# EasyEDA Pro project port.eprj

# Schematic Schematic1
Board Name: Board1; Create Date: 2025-05-24; Page Name: P1; Project Name: port_2025-05-24_13-21-27; Schematic Name: Schematic1; Update Date: 2025-05-24; Company: 嘉立创EDA; Page Size: A4; Version: V1.0
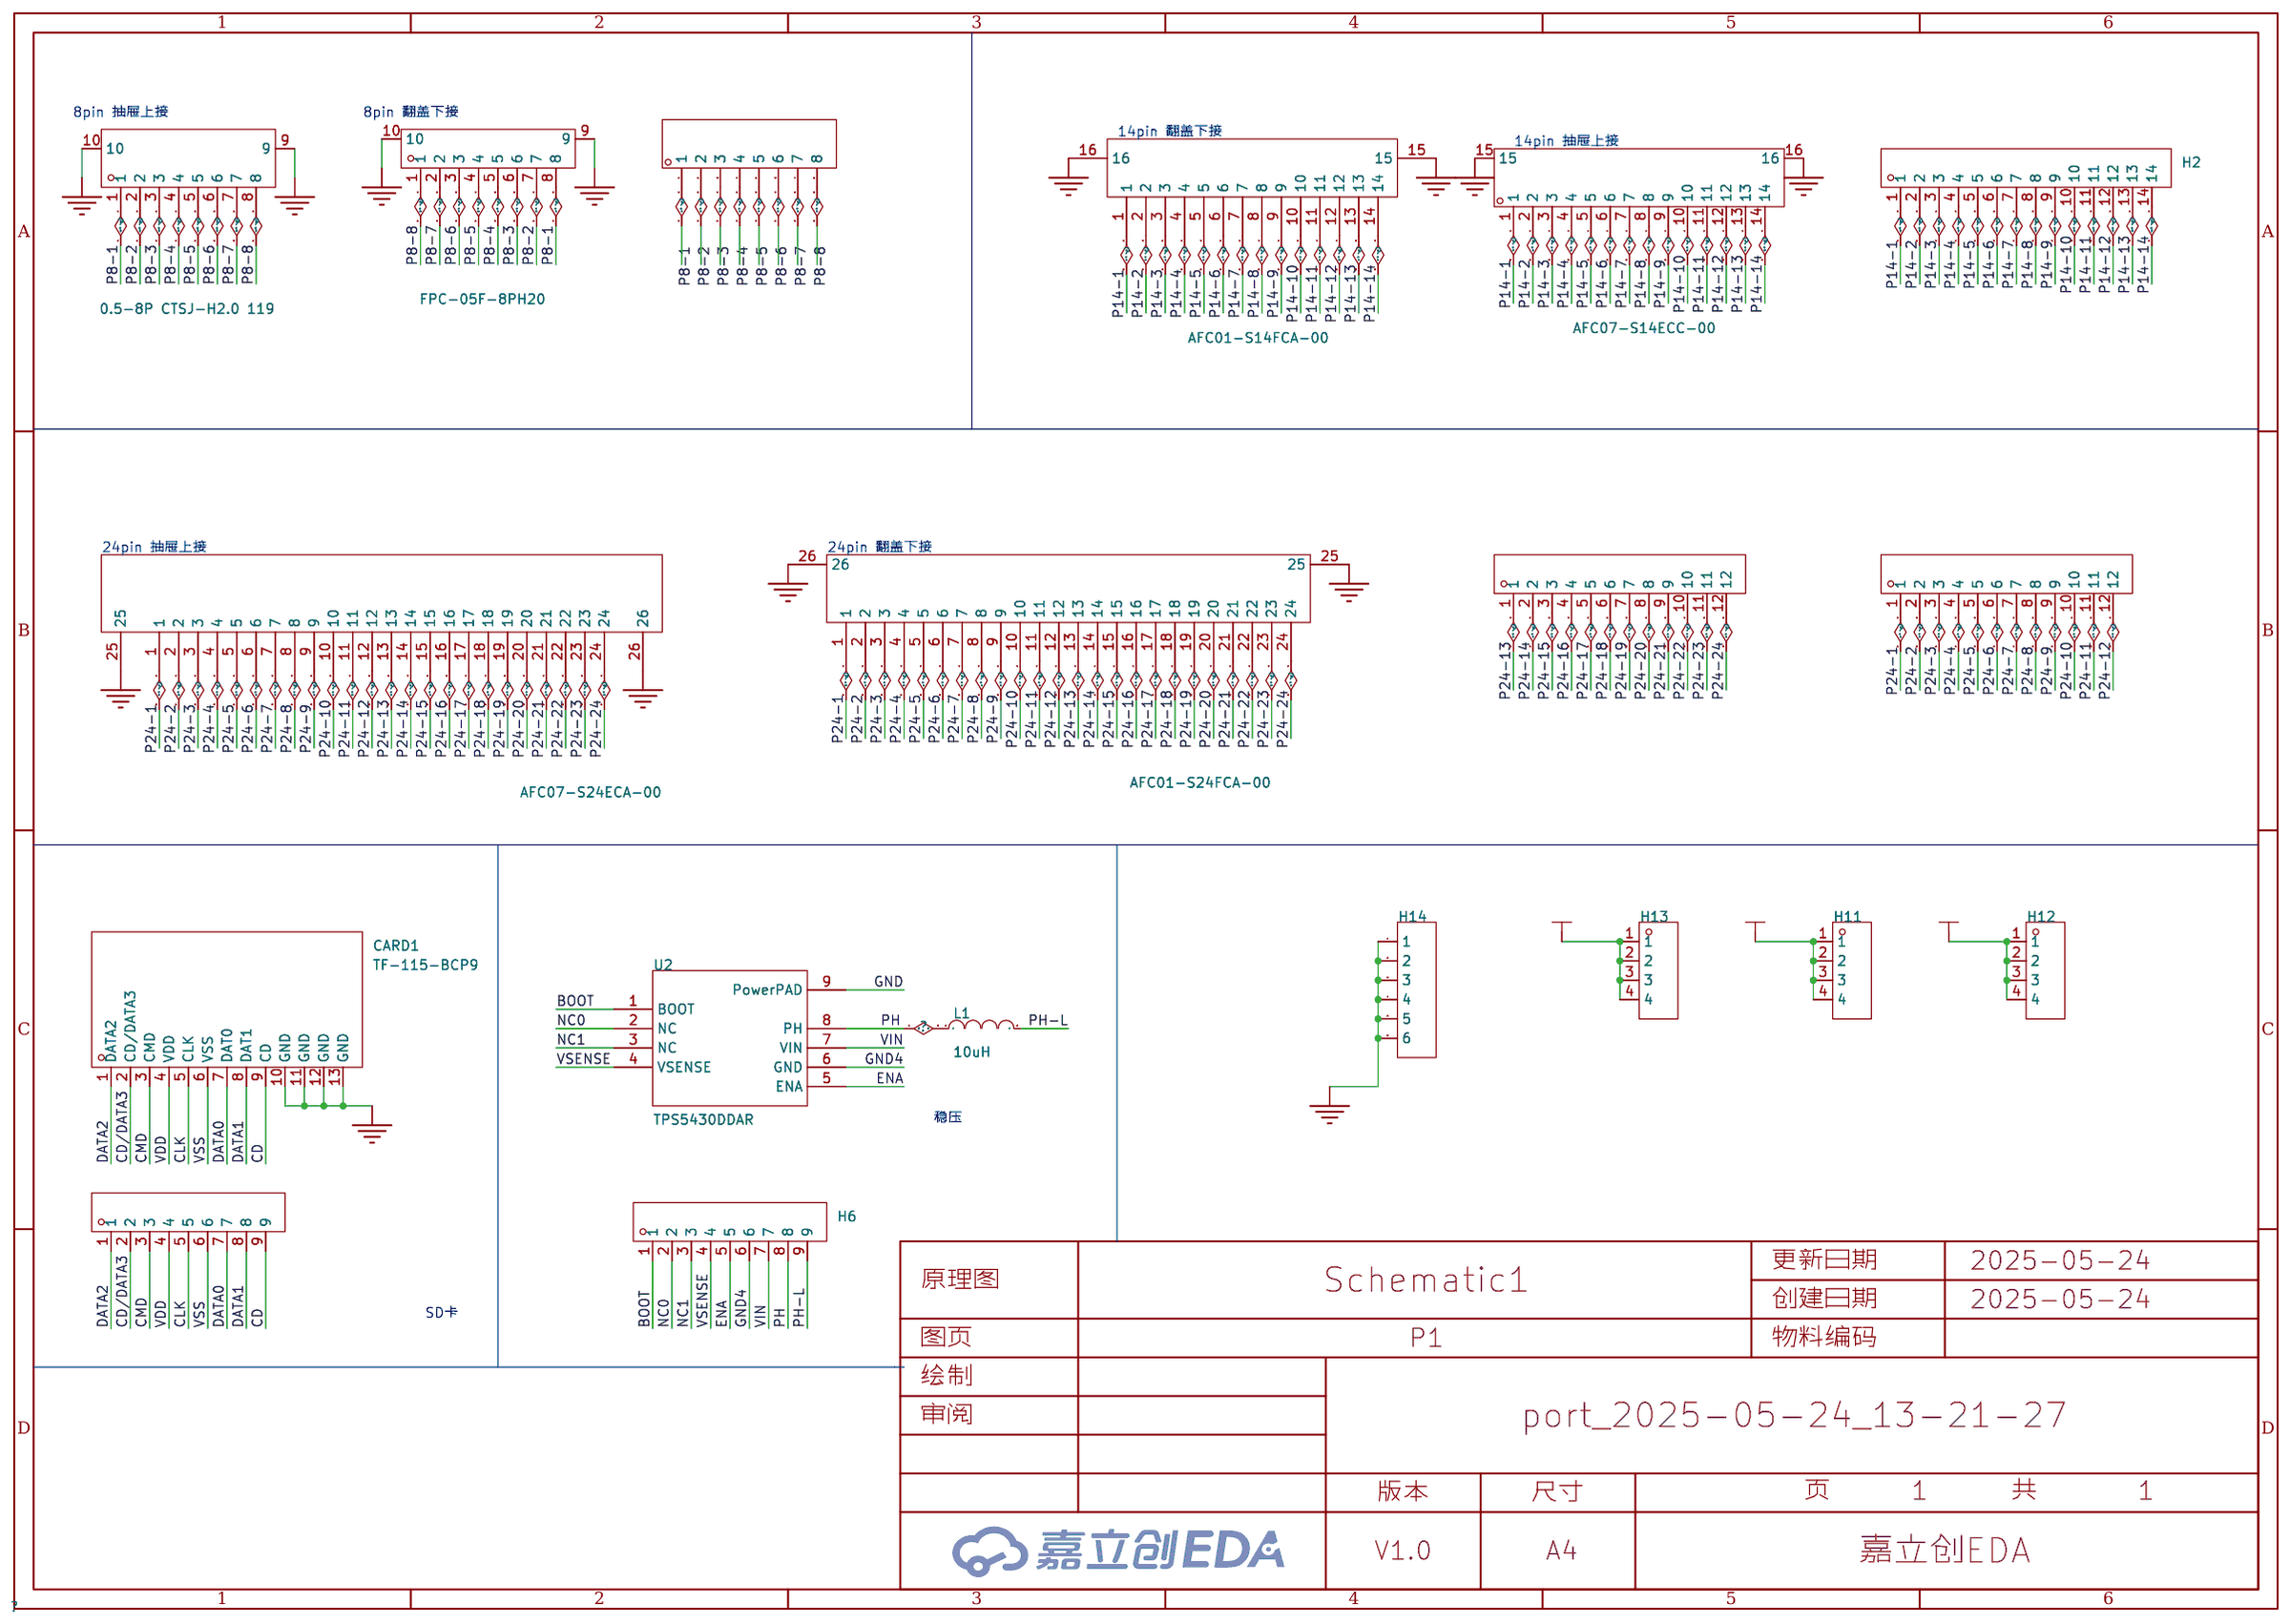
[diagram p0: schematic sheet]

## Parts
CARD1  TF-115-BCP9  [TF-SMD_TF-115-BCP9]
FPC1  FPC-05F-8PH20  [FPC-SMD_8P-P0.50_FPC-05F-8PH20]
FPC2  AFC07-S24ECA-00  [FPC-SMD_AFC07-S24ECA-00]
FPC3  AFC01-S24FCA-00  [FPC-SMD_24P-P0.50_AFC01-S24FCA-00]
H1  -  [HDR-TH_8P-P2.54-V-M]
H2  -  [HDR-TH_14P-P2.54-V-M]
H3  -  [HDR-TH_12P-P2.54-V-M]
H4  -  [HDR-TH_12P-P2.54-V-M]
H6  -  [HDR-TH_9P-P2.54-V-M]
H10  -  [HDR-TH_9P-P2.54-V-M]
H11  -  [HDR-TH_4P-P2.54-V-M]
H12  -  [HDR-TH_4P-P2.54-V-M]
H13  -  [HDR-TH_4P-P2.54-V-M]
H14  -  [HDR-TH_6P-P2.54-V-M-1]
L1  10uH  [L0805]
P1  AFC07-S14ECC-00  [FPC-SMD_14P-L12.5-W5.4-P0.50]
U1  0.5-8P CTSJ-H2.0 119  [FPC-SMD_8P-P0.50_SHOUHAN_CTSJ-H2.0]
U2  TPS5430DDAR  [ESOP-8_L4.9-W3.9-P1.27-LS6.0-TL-EP]
X1  AFC01-S14FCA-00  [FPC-SMD_AFC01-S14FCA-00]

## Library data of the parts
CARD1 = TF-115-BCP9: 卡连接方式:自弹式;卡类型:MicroSD卡(TF卡);连接器类型:卡座;本体最大高度:1.8mm;工作温度范围:-25℃~+85℃;; LCSC Part Name: 自弹式 MicroSD卡(TF卡) 卡座; Supplier Part: C720505; Manufacturer: XUNPU(讯普); Supplier Footprint: SMD; JLCPCB Part Class: 扩展库; Datasheet: https://atta.szlcsc.com/upload/public/pdf/source/20210906/DBEC8F03AA1503572333C7CF4A76D0AD.pdf; Supplier: LCSC; Card Connection Mode: 自弹式; Card Type: MicroSD卡(TF卡); Connector Type: 卡座; Maximum Body Height: 1.8mm; Operating Temperature Range: -25℃~+85℃
FPC1 = FPC-05F-8PH20: LCSC Part Name: 间距:0.5mm P数:8P 翻盖式 下接; Supplier Part: C2856797; Manufacturer: XUNPU(讯普); Supplier Footprint: SMD,P=0.5mm,卧贴; JLCPCB Part Class: 扩展库; Datasheet: https://atta.szlcsc.com/upload/public/pdf/source/20210728/C2856796_EA80EFD10E16055FE067E7763B90421F.pdf; Supplier: LCSC; Locking Feature: 翻盖式; Contact Type: 下接; Number of Contacts: 8P; Pitch: 0.5mm; Mounting Type: 卧贴; FFC, FCB Thickness: 0.3mm; Height Above Board: 2mm; Operating Temperature Range: -25℃~+85℃
FPC2 = AFC07-S24ECA-00: LCSC Part Name: 间距:0.5mm P数:24P 抽屉式 上接; Supplier Part: C262643; Manufacturer: JS(钜硕电子); Supplier Footprint: SMD,P=0.5mm,卧贴; JLCPCB Part Class: 扩展库; Datasheet: https://atta.szlcsc.com/upload/public/pdf/source/20190726/C11082_A2E7B12387019CE4314BB5199EE0FDF4.pdf; Supplier: LCSC; Locking Feature: 抽屉式; Contact Type: 上接; Number of Contacts: 24P; Pitch: 0.5mm; Mounting Type: 卧贴; FFC, FCB Thickness: 0.3mm; Height Above Board: 2mm
FPC3 = AFC01-S24FCA-00: LCSC Part Name: 间距:0.5mm P数:24P 翻盖式 下接; Supplier Part: C262669; Manufacturer: JS(钜硕电子); Supplier Footprint: SMD,P=0.5mm,卧贴; JLCPCB Part Class: 扩展库; Datasheet: https://atta.szlcsc.com/upload/public/pdf/source/20190816/C413942_2A72D1AC756EAE17EEDF756A339D4500.pdf; Supplier: LCSC; Locking Feature: 翻盖式; Contact Type: 下接; Number of Contacts: 24P; Pitch: 0.5mm; Mounting Type: 卧贴; FFC, FCB Thickness: 0.3mm; Height Above Board: 2mm
H1 = HDR-M_2.54_1x8P: Supplier Part: C124381; Supplier Footprint: 插件
H2 = HDR-M_2.54_1x14P: Supplier Part: C2894937; Supplier Footprint: 插件
H3 H4 = HDR-M_2.54_1x12P: Supplier Part: C2840012; Supplier Footprint: 插件
H6 H10 = HDR-M_2.54-1x9P: Supplier Part: C492408; Supplier Footprint: 插件
H11-H13 = HDR-M_2.54_1x4P: Supplier Part: C492403; Supplier Footprint: 插件
H14 = HDR-M_2.54_1x6P: Supplier Part: C37208; Supplier Footprint: 插件
L1 = L_0805
P1 = AFC07-S14ECC-00: LCSC Part Name: 间距:0.5mm P数:14P 抽屉式 上接; Supplier Part: C11087; Manufacturer: JS(钜硕电子); Supplier Footprint: SMD,P=0.5mm,卧贴; JLCPCB Part Class: 扩展库; Datasheet: https://atta.szlcsc.com/upload/public/pdf/source/20130129/1457706582878.pdf; Supplier: LCSC; Locking Feature: 抽屉式; Contact Type: 上接; Number of Contacts: 14P; Pitch: 0.5mm; Mounting Type: 卧贴; FFC, FCB Thickness: 0.3mm; Height Above Board: 2mm
U1 = 0.5-8P CTSJ-H2.0 119: LCSC Part Name: 抽屉式 上接 P数:8P 间距:0.5mm; Supplier Part: C5373445; Manufacturer: SHOU HAN(首韩); Supplier Footprint: SMD,P=0.5mm,卧贴; JLCPCB Part Class: 扩展库; Datasheet: https://atta.szlcsc.com/upload/public/pdf/source/20230321/75B120D7DB190323108EF86CD5D5939A.pdf; Supplier: LCSC; Locking Feature: 抽屉式; Contact Type: 上接; Number of Contacts: 8P; Pitch: 0.5mm; Mounting Type: 卧贴; FFC, FCB Thickness: 0.3mm; Height Above Board: 2mm; Contact Material: 磷青铜; Contact Plating: 锡; Operating Temperature Range: -55℃~+85℃
U2 = TPS5430DDAR: LCSC Part Name: 宽输入范围、3A输出电流的降压转换器; Supplier Part: C9864; Manufacturer: TI(德州仪器); Supplier Footprint: SOIC-8-EP; JLCPCB Part Class: 基础库; Datasheet: https://www.ti.com/cn/lit/gpn/tps5430; Supplier: LCSC; Function: 降压型; Output Type: 可调; Input Voltage: 5.5V~36V; Output Voltage: 1.221V~32.04V; Output Current: 3A; Switching Frequency: 500kHz; Operating Temperature: -40℃~+125℃@(TJ); Synchronous Rectification: 否; Number of Outputs: 1; Topology: 降压式; Switch tube (built-in/external): 内置
X1 = AFC01-S14FCA-00: LCSC Part Name: 间距:0.5mm P数:14P 翻盖式 下接; Supplier Part: C262663; Manufacturer: JS(钜硕电子); Supplier Footprint: SMD,P=0.5mm,卧贴; JLCPCB Part Class: 扩展库; Datasheet: https://atta.szlcsc.com/upload/public/pdf/source/20190816/C413942_2A72D1AC756EAE17EEDF756A339D4500.pdf; Supplier: LCSC; Locking Feature: 翻盖式; Contact Type: 下接; Number of Contacts: 14P; Pitch: 0.5mm; Mounting Type: 卧贴; FFC, FCB Thickness: 0.3mm; Height Above Board: 2mm

## Nets
GND: CARD1.10(GND) CARD1.11(GND) CARD1.12(GND) CARD1.13(GND) FPC1.9 FPC1.10 FPC2.25 FPC2.26 FPC3.25 FPC3.26 H14.1 H14.2 H14.3 H14.4 H14.5 H14.6 P1.15 P1.16 U1.9 U1.10 U2.9(PowerPAD) X1.15 X1.16
GND4: H6.6 U2.6(GND)
VDD: CARD1.4(VDD) H10.4
VIN: H6.7 U2.7(VIN)
VSS: CARD1.6(VSS) H10.6
BOOT: H6.1 U2.1(BOOT)
CD: CARD1.9(CD) H10.9
CD/DATA3: CARD1.2(CD/DATA3) H10.2
CLK: CARD1.5(CLK) H10.5
CMD: CARD1.3(CMD) H10.3
DATA0: CARD1.7(DAT0) H10.7
DATA1: CARD1.8(DAT1) H10.8
DATA2: CARD1.1(DATA2) H10.1
ENA: H6.5 U2.5(ENA)
NC0: H6.2 U2.2(NC)
NC1: H6.3 U2.3(NC)
P8-1: FPC1.8 H1.1 U1.1
P8-2: FPC1.7 H1.2 U1.2
P8-3: FPC1.6 H1.3 U1.3
P8-4: FPC1.5 H1.4 U1.4
P8-5: FPC1.4 H1.5 U1.5
P8-6: FPC1.3 H1.6 U1.6
P8-7: FPC1.2 H1.7 U1.7
P8-8: FPC1.1 H1.8 U1.8
P14-1: H2.1 P1.1 X1.1
P14-2: H2.2 P1.2 X1.2
P14-3: H2.3 P1.3 X1.3
P14-4: H2.4 P1.4 X1.4
P14-5: H2.5 P1.5 X1.5
P14-6: H2.6 P1.6 X1.6
P14-7: H2.7 P1.7 X1.7
P14-8: H2.8 P1.8 X1.8
P14-9: H2.9 P1.9 X1.9
P14-10: H2.10 P1.10 X1.10
P14-11: H2.11 P1.11 X1.11
P14-12: H2.12 P1.12 X1.12
P14-13: H2.13 P1.13 X1.13
P14-14: H2.14 P1.14 X1.14
P24-1: FPC2.1 FPC3.1 H3.1
P24-2: FPC2.2 FPC3.2 H3.2
P24-3: FPC2.3 FPC3.3 H3.3
P24-4: FPC2.4 FPC3.4 H3.4
P24-5: FPC2.5 FPC3.5 H3.5
P24-6: FPC2.6 FPC3.6 H3.6
P24-7: FPC2.7 FPC3.7 H3.7
P24-8: FPC2.8 FPC3.8 H3.8
P24-9: FPC2.9 FPC3.9 H3.9
P24-10: FPC2.10 FPC3.10 H3.10
P24-11: FPC2.11 FPC3.11 H3.11
P24-12: FPC2.12 FPC3.12 H3.12
P24-13: FPC2.13 FPC3.13 H4.1
P24-14: FPC2.14 FPC3.14 H4.2
P24-15: FPC2.15 FPC3.15 H4.3
P24-16: FPC2.16 FPC3.16 H4.4
P24-17: FPC2.17 FPC3.17 H4.5
P24-18: FPC2.18 FPC3.18 H4.6
P24-19: FPC2.19 FPC3.19 H4.7
P24-20: FPC2.20 FPC3.20 H4.8
P24-21: FPC2.21 FPC3.21 H4.9
P24-22: FPC2.22 FPC3.22 H4.10
P24-23: FPC2.23 FPC3.23 H4.11
P24-24: FPC2.24 FPC3.24 H4.12
PH: H6.8 L1.1 U2.8(PH)
PH-L: H6.9 L1.2
PIN0: H11.1 H11.2 H11.3 H11.4
PIN1: H12.1 H12.2 H12.3 H12.4
PIN2: H13.1 H13.2 H13.3 H13.4
VSENSE: H6.4 U2.4(VSENSE)

## Notes on the sheet
- 8pin 抽屉上接
- 8pin 翻盖下接
- 14pin 翻盖下接
- 14pin 抽屉上接
- 24pin 抽屉上接
- 24pin 翻盖下接
- 稳压
- SD卡

# Board PCB1
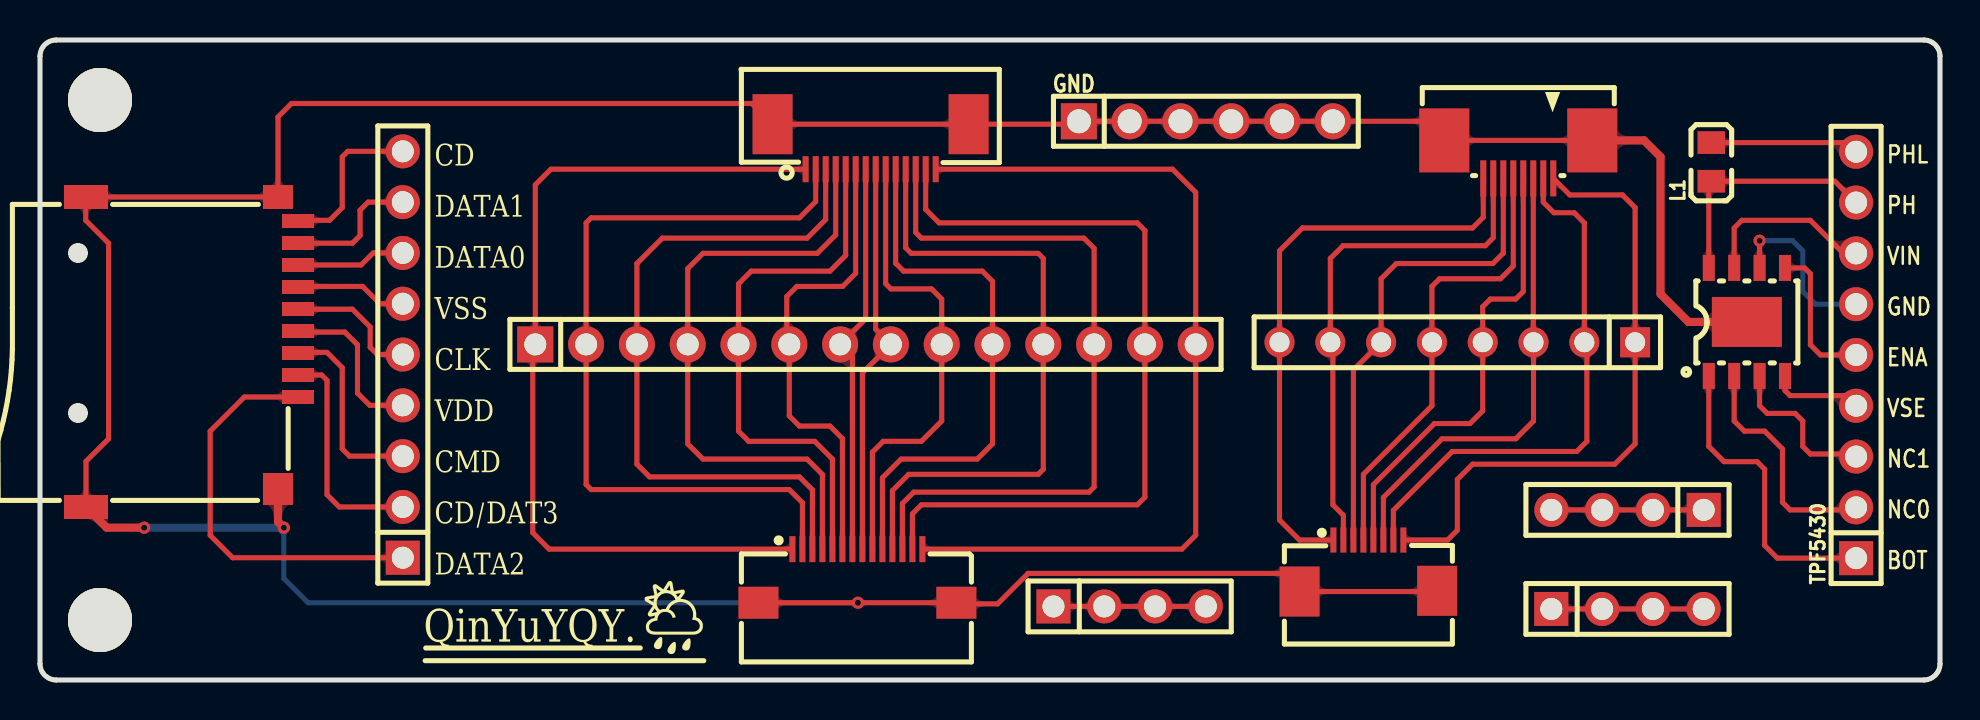
[diagram p1: board, top side]
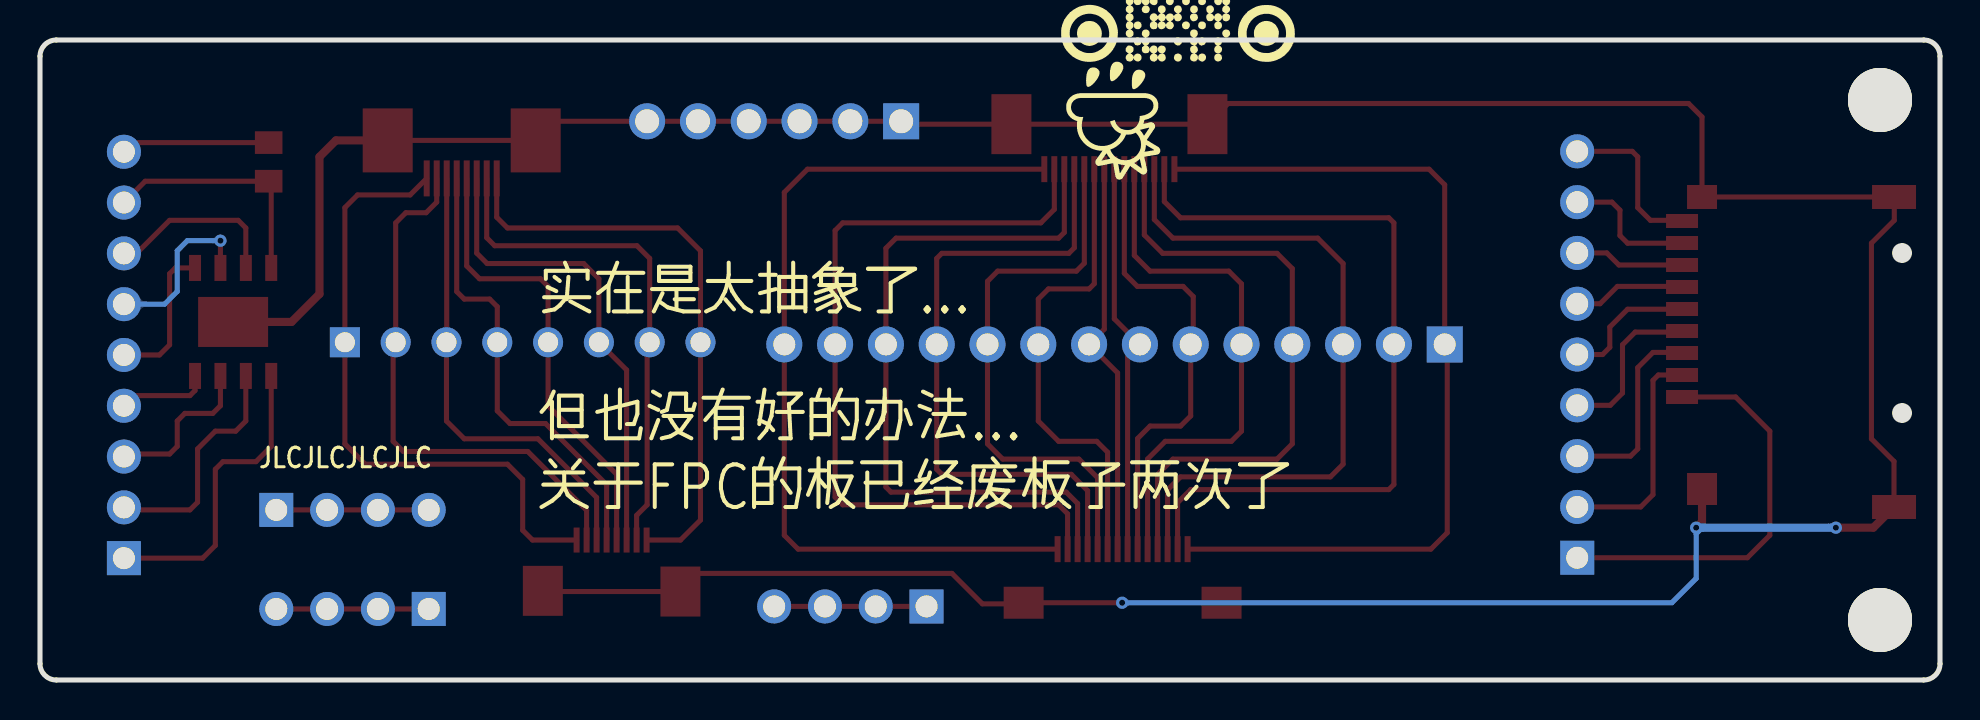
[diagram p2: board, bottom side, seen from below]

Outline 95 x 32 mm; copper layers: Top Layer, Bottom Layer. Coordinates in mm from the lower left corner of the outline.
Outline path: 0,31.19 0,0.81 arc(0.24,0.24) 0.81,0 94.19,0 arc(94.76,0.24) 95,0.81 95,31.19 arc(94.76,31.76) 94.19,32 0.81,32 arc(0.24,31.76) 0,31.19
Stack: Top Layer 0.035mm / Dielectric1 1.51mm FR4 er 4.5 / Bottom Layer 0.035mm

## Design rules (mm)
template: 自定义配置
spacing copperThickness1oz (default): track to track 0.102, other pairs 0.102 to 0.3
spacing copperThickness2oz: track to track 0.203, other pairs 0.152 to 0.3
track width copperThickness1oz (default): min 0.127, default 0.254, max 2.54
track width copperThickness2oz: min 0.203, default 0.254, max 2.54
differential pair differentialPair (default): width min 0.127, default 0.254, max 2.54; gap min 0.152, default 0.152
via viaSize (default): diameter min 0.5, default 0.61, max 10; hole min 0.3, default 0.305, max 6.299

## Placement (name value [footprint] x y rotation side)
CARD1  TF-115-BCP9  [TF-SMD_TF-115-BCP9]  7.6 16.4 270 top
FPC1  FPC-05F-8PH20  [FPC-SMD_8P-P0.50_FPC-05F-8PH20]  66.42 5.71 0 top
H1  -  [HDR-TH_8P-P2.54-V-M]  70.87 16.89 180 top
H2  -  [HDR-TH_14P-P2.54-V-M]  41.28 16.78 0 top
H10  -  [HDR-TH_9P-P2.54-V-M]  18.14 16.27 90 top
H11  -  [HDR-TH_4P-P2.54-V-M]  54.48 3.68 0 top
H12  -  [HDR-TH_4P-P2.54-V-M]  79.38 3.55 0 top
H13  -  [HDR-TH_4P-P2.54-V-M]  79.38 8.5 180 top
H14  -  [HDR-TH_6P-P2.54-V-M-1]  58.29 27.94 0 top
L1  10uH  [L0805]  83.57 25.9 90 top
P1  AFC07-S14ECC-00  [FPC-SMD_14P-L12.5-W5.4-P0.50]  41.53 26.67 180 top
SCREW1  -  [M3螺丝]  3 29 0 top
SCREW2  -  [M3螺丝]  3 3 0 top
TPF5430  -  [HDR-TH_9P-P2.54-V-M]  90.81 16.25 90 top
U1  0.5-8P CTSJ-H2.0 119  [FPC-SMD_8P-P0.50_SHOUHAN_CTSJ-H2.0]  73.91 26.03 180 top
U2  TPS5430DDAR  [ESOP-8_L4.9-W3.9-P1.27-LS6.0-TL-EP]  85.34 17.9 90 top
X1  AFC01-S14FCA-00  [FPC-SMD_AFC01-S14FCA-00]  40.87 5.2 0 top

## Footprints (pads in the part's own frame, mm; a bottom-side part is the same pattern mirrored in y, then rotated)
ESOP-8_L4.9-W3.9-P1.27-LS6.0-TL-EP
  rect 1.3x0.6 smd: 1(-2.7,1.905) 2(-2.7,0.635) 3(-2.7,-0.635) 4(-2.7,-1.905) 5(2.7,-1.905) 6(2.7,-0.635) 7(2.7,0.635) 8(2.7,1.905)
  rect 2.5x3.5 smd: 9(0,0)
FPC-SMD_8P-P0.50_FPC-05F-8PH20
  rect 0.3x1.25 smd: 1(-1.75,1.288) 2(-1.25,1.288) 3(-0.75,1.288) 4(-0.25,1.288) 5(0.25,1.288) 6(0.75,1.288) 7(1.25,1.288) 8(1.75,1.288)
  rect 2x2.5 smd: 9(3.44,-1.252) 10(-3.44,-1.288)
FPC-SMD_8P-P0.50_SHOUHAN_CTSJ-H2.0
  rect 0.3x1.8 smd: 1(-1.75,0.95) 2(-1.25,0.95) 3(-0.75,0.95) 4(-0.25,0.95) 5(0.25,0.95) 6(0.75,0.95) 7(1.25,0.95) 8(1.75,0.95)
  rect 2.5x3.2 smd: 9(3.7,-0.95) 10(-3.7,-0.95)
FPC-SMD_14P-L12.5-W5.4-P0.50
  rect 0.3x1.3 smd: 1(3.249,1.125) 2(2.745,1.125) 3(2.245,1.125) 4(1.745,1.125) 5(1.245,1.125) 6(0.745,1.125) 7(0.245,1.125) 8(-0.255,1.125) 9(-0.755,1.125) 10(-1.255,1.125) 11(-1.755,1.125) 12(-2.255,1.125) 13(-2.755,1.125) 14(-3.255,1.125)
  rect 2x3 smd: 15(-4.901,-1.125) 16(4.901,-1.125)
FPC-SMD_AFC01-S14FCA-00
  rect 0.3x1.3 smd: 1(-3.25,1.34) 2(-2.75,1.339) 3(-2.25,1.34) 4(-1.75,1.34) 5(-1.25,1.34) 6(-0.75,1.34) 7(-0.25,1.34) 8(0.25,1.34) 9(0.75,1.34) 10(1.25,1.34) 11(1.75,1.34) 12(2.25,1.34) 13(2.75,1.34) 14(3.25,1.34)
  rect 2x1.6 smd: 15(4.948,-1.34) 16(-4.948,-1.34)
HDR-TH_4P-P2.54-V-M
  rect 1.7x1.7 hole 1.1: 1(-3.81,0)
  round 1.7 hole 1.1: 2(-1.27,0) 3(1.27,0) 4(3.81,0)
HDR-TH_6P-P2.54-V-M-1
  rect 1.8x1.8 hole 1.2: 1(-6.35,0)
  round 1.8 hole 1.2: 2(-3.81,0) 3(-1.27,0) 4(1.27,0) 5(3.81,0) 6(6.35,0)
HDR-TH_8P-P2.54-V-M
  rect 1.5x1.5 hole 1: 1(-8.89,0)
  round 1.5 hole 1: 2(-6.35,0) 3(-3.81,0) 4(-1.27,0) 5(1.27,0) 6(3.81,0) 7(6.35,0) 8(8.89,0)
HDR-TH_9P-P2.54-V-M
  rect 1.7x1.7 hole 1.1: 1(-10.16,0)
  round 1.7 hole 1.1: 2(-7.62,0) 3(-5.08,0) 4(-2.54,0) 5(0,0) 6(2.54,0) 7(5.08,0) 8(7.62,0) 9(10.16,0)
HDR-TH_14P-P2.54-V-M
  rect 1.8x1.8 hole 1.1: 1(-16.51,0)
  round 1.8 hole 1.1: 2(-13.97,0) 3(-11.43,0) 4(-8.89,0) 5(-6.35,0) 6(-3.81,0) 7(-1.27,0) 8(1.27,0) 9(3.81,0) 10(6.35,0) 11(8.89,0) 12(11.43,0) 13(13.97,0) 14(16.51,0)
L0805
  rect 1.133x1.377 smd: 1(-0.966,0) 2(0.966,0)
M3螺丝
  round 3.2 hole 3.2: 1(0,0)
TF-SMD_TF-115-BCP9
  rect 0.7x1.6 smd: 1(2.25,5.3) 2(1.15,5.3) 3(0.05,5.3) 4(-1.05,5.3) 5(-2.15,5.3) 6(-3.25,5.3) 7(-4.35,5.3) 8(-5.45,5.3) 9(-6.55,5.3)
  rect 1.2x1.5 smd: 10(-7.75,4.3)
  rect 1.2x2.2 smd: 11(-7.75,-5.3) 13(7.75,-5.3)
  rect 1.6x1.5 smd: 12(6.85,4.3)

## Nets
GND: CARD1.10 CARD1.11 CARD1.12 CARD1.13 FPC1.9 FPC1.10 H14.1 H14.2 H14.3 H14.4 H14.5 H14.6 P1.15 P1.16 U1.9 U1.10 U2.9 X1.15 X1.16
GND4: TPF5430.6 U2.6
VDD: CARD1.4 H10.4
VIN: TPF5430.7 U2.7
VSS: CARD1.6 H10.6
BOOT: TPF5430.1 U2.1
CD: CARD1.9 H10.9
CD/DATA3: CARD1.2 H10.2
CLK: CARD1.5 H10.5
CMD: CARD1.3 H10.3
DATA0: CARD1.7 H10.7
DATA1: CARD1.8 H10.8
DATA2: CARD1.1 H10.1
ENA: TPF5430.5 U2.5
NC0: TPF5430.2 U2.2
NC1: TPF5430.3 U2.3
P8-1: FPC1.8 H1.1 U1.1
P8-2: FPC1.7 H1.2 U1.2
P8-3: FPC1.6 H1.3 U1.3
P8-4: FPC1.5 H1.4 U1.4
P8-5: FPC1.4 H1.5 U1.5
P8-6: FPC1.3 H1.6 U1.6
P8-7: FPC1.2 H1.7 U1.7
P8-8: FPC1.1 H1.8 U1.8
P14-1: H2.1 P1.1 X1.1
P14-2: H2.2 P1.2 X1.2
P14-3: H2.3 P1.3 X1.3
P14-4: H2.4 P1.4 X1.4
P14-5: H2.5 P1.5 X1.5
P14-6: H2.6 P1.6 X1.6
P14-7: H2.7 P1.7 X1.7
P14-8: H2.8 P1.8 X1.8
P14-9: H2.9 P1.9 X1.9
P14-10: H2.10 P1.10 X1.10
P14-11: H2.11 P1.11 X1.11
P14-12: H2.12 P1.12 X1.12
P14-13: H2.13 P1.13 X1.13
P14-14: H2.14 P1.14 X1.14
PH: L1.1 TPF5430.8 U2.8
PH-L: L1.2 TPF5430.9
PIN0: H11.1 H11.2 H11.3 H11.4
PIN1: H12.1 H12.2 H12.3 H12.4
PIN2: H13.1 H13.2 H13.3 H13.4
VSENSE: TPF5430.4 U2.4

Pads without a net: SCREW1 1; SCREW2 1

## Via types
v1: diameter 0.61, hole 0.305, Top Layer to Bottom Layer, 4 vias

## Routing (per net, layer and track width the routed paths; a pad name or vN(x,y) marks a point on that pad's centre or on a via; arc(x,y) is an arc through that point)
GND: length 191.7
  Top Layer w0.254: X1.16 v1(40.89,3.86) X1.15 45.88,3.81 47.88,3.81 49.4,5.33 62.07,5.33 FPC1.10 69.82,4.42 FPC1.9 ; 46.43,27.79 P1.16 35.59,28.83 12.57,28.83 11.9,28.15 CARD1.10 CARD1.11 2.29,24.14 2.29,22.98 3.43,21.84 3.43,12.06 2.3,10.93 CARD1.13 ; P1.15 51.8,27.79 H14.1 H14.2 H14.3 H14.4 H14.5 H14.6 69.26,27.94 70.21,26.98 77.61,26.98
  Top Layer w0.406: v1(12.19,7.62) 11.9,7.91 CARD1.12 ; CARD1.13 3.33,7.62 v1(5.21,7.62) ; 77.61,26.98 80.2,26.98 81.03,26.16 81.03,19.3 82.42,17.9 U2.9
  Bottom Layer w0.254: v1(40.89,3.86) 13.41,3.86 12.19,5.08 12.19,7.31 11.89,7.62
  Bottom Layer w0.406: v1(5.21,7.62) v1(12.19,7.62)
GND4: length 8.7
  Top Layer w0.254: 85.98,20.6 v1(85.98,21.97)
  Bottom Layer w0.254: TPF5430.6 88.77,18.79 88.14,19.43 88.14,21.46 87.63,21.97 v1(85.98,21.97)
VDD: length 8.2
  Top Layer w0.254: CARD1.4 12.95,17.39 15.24,17.39 15.88,16.76 15.88,14.35 16.49,13.73 H10.4
VIN: length 8.9
  Top Layer w0.254: U2.7 84.71,22.6 85.09,22.98 88.52,22.98 90.17,21.33 TPF5430.7
VSS: length 5.6
  Top Layer w0.254: H10.6 17,18.81 16.13,19.68 12.93,19.68 CARD1.6
BOOT: length 15.4
  Top Layer w0.254: TPF5430.1 86.87,6.09 86.23,6.73 86.23,10.54 85.85,10.92 84.2,10.92 83.44,11.68 U2.1
CD: length 8.2
  Top Layer w0.254: CARD1.9 12.93,22.98 14.48,22.98 15.11,23.62 15.11,26.16 15.39,26.43 H10.9
CD/DATA3: length 11.3
  Top Layer w0.254: CARD1.2 14.08,15.25 14.35,14.98 14.35,9.27 14.97,8.65 H10.2
CLK: length 6.8
  Top Layer w0.254: H10.5 16.87,16.27 16.51,16.63 16.51,17.65 15.62,18.54 12.91,18.54 CARD1.5
CMD: length 9.8
  Top Layer w0.254: H10.3 15.47,11.19 15.11,11.55 15.11,15.62 14.35,16.38 12.93,16.38 CARD1.3
DATA0: length 5.5
  Top Layer w0.254: CARD1.7 16.06,20.75 16.66,21.35 H10.7
DATA1: length 6.8
  Top Layer w0.254: CARD1.8 12.91,21.84 15.62,21.84 16,22.22 16,23.49 16.4,23.89 H10.8
DATA2: length 20.4
  Top Layer w0.254: H10.1 9.63,6.11 8.51,7.23 8.51,12.44 10.22,14.15 CARD1.1
ENA: length 7.4
  Top Layer w0.254: U2.5 88.23,20.6 88.52,20.32 88.52,16.76 89.03,16.25 TPF5430.5
NC0: length 11.8
  Top Layer w0.254: U2.2 84.71,12.95 85.22,12.44 86.23,12.44 87.12,11.55 87.12,8.89 87.5,8.5 90.68,8.5 TPF5430.2
NC1: length 8.1
  Top Layer w0.254: TPF5430.3 90.68,11.3 88.52,11.3 88.14,11.68 88.14,12.95 87.76,13.33 86.36,13.33 85.98,13.71 85.98,15.2
P8-1: length 31.6
  Top Layer w0.254: U1.1 76.49,24.25 79.12,24.25 79.76,23.62 H1.1 79.76,11.81 78.74,10.79 71.63,10.79 70.87,10.03 70.87,7.49 70.38,7 FPC1.8
P8-2: length 27.2
  Top Layer w0.254: U1.2 75.16,23.89 75.69,23.36 76.71,23.36 77.22,22.86 H1.2 77.34,16.76 77.34,11.93 76.84,11.43 70.61,11.43 67.67,8.48 FPC1.7
P8-3: length 23.4
  Top Layer w0.254: U1.3 74.66,16.9 H1.3 74.68,12.95 73.79,12.06 70.1,12.06 67.17,9.13 FPC1.6
P8-4: length 23
  Top Layer w0.254: U1.4 74.16,19.42 73.79,19.05 72.52,19.05 72.14,18.67 H1.4 72.14,13.46 71.5,12.82 69.72,12.82 66.67,9.77 FPC1.5
P8-5: length 23
  Top Layer w0.254: U1.5 73.66,20.7 73.03,20.06 69.98,20.06 69.6,19.68 H1.5 69.6,13.71 66.17,10.28 FPC1.4
P8-6: length 24
  Top Layer w0.254: U1.6 73.16,21.34 72.64,20.82 67.82,20.82 67.06,20.06 H1.6 65.67,15.5 FPC1.3
P8-7: length 25.9
  Top Layer w0.254: U1.7 72.66,22.11 72.26,21.71 65.15,21.71 64.52,21.08 H1.7 64.64,16.76 64.64,8.76 65.17,8.23 FPC1.2
P8-8: length 29.4
  Top Layer w0.254: FPC1.1 62.97,7 61.98,8 H1.8 61.98,21.46 63.12,22.6 71.63,22.6 72.16,23.14 U1.8
P14-1: length 44.6
  Top Layer w0.254: X1.1 25.46,6.54 24.64,7.36 24.64,16.65 H2.1 24.77,24.76 25.55,25.54 P1.1
P14-2: length 40.1
  Top Layer w0.254: X1.2 38.12,8.87 37.47,9.52 27.56,9.52 27.31,9.78 H2.2 27.31,22.86 27.56,23.11 37.97,23.11 38.78,23.92 P1.2
P14-3: length 35.2
  Top Layer w0.254: X1.3 38.62,9.51 37.97,10.16 30.48,10.16 29.84,10.79 H2.3 29.84,20.82 31.12,22.09 38.35,22.09 39.28,23.02 P1.3
P14-4: length 31.3
  Top Layer w0.254: P1.4 39.78,22.25 38.86,21.33 33.15,21.33 32.38,20.57 H2.4 32.38,11.81 33.15,11.05 38.35,11.05 39.12,10.28 X1.4
P14-5: length 27.4
  Top Layer w0.254: X1.5 39.62,11.05 38.74,11.93 35.43,11.93 34.93,12.44 H2.5 34.93,19.81 35.56,20.44 39.5,20.44 40.28,21.23 P1.5
P14-6: length 23.8
  Top Layer w0.254: X1.6 40.12,12.07 39.5,12.7 37.97,12.7 37.47,13.2 H2.6 37.34,16.91 37.34,19.17 37.85,19.68 40.13,19.68 40.78,20.33 P1.6
P14-7: length 19.8
  Top Layer w0.254: P1.7 41.28,18.06 H2.7 40.62,16.16 X1.7
P14-8: length 19.9
  Top Layer w0.254: P1.8 41.78,17.54 42.54,16.78 41.12,15.36 X1.8
P14-9: length 23.9
  Top Layer w0.254: X1.9 41.62,11.39 42.16,11.93 44.07,11.93 45.09,12.95 H2.9 45.09,19.05 44.58,19.55 42.54,19.55 42.28,19.81 P1.9
P14-10: length 27.8
  Top Layer w0.254: X1.10 42.12,10.11 43.05,11.05 46.86,11.05 47.62,11.81 H2.10 47.62,19.94 47.12,20.44 43.18,20.44 42.78,20.84 P1.10
P14-11: length 32.5
  Top Layer w0.254: X1.11 42.62,9.47 43.43,10.28 49.91,10.28 50.16,10.54 50.16,21.08 49.91,21.33 43.56,21.33 43.28,21.61 P1.11
P14-12: length 36.6
  Top Layer w0.254: P1.12 43.78,22.38 44.07,22.09 52.2,22.09 52.71,21.59 H2.12 52.71,9.65 52.45,9.39 43.69,9.39 43.12,8.83 X1.12
P14-13: length 40.5
  Top Layer w0.254: X1.13 43.62,8.31 44.07,8.76 54.86,8.76 55.25,9.14 H2.13 55.25,22.47 54.86,22.86 44.96,22.86 44.28,23.53 P1.13
P14-14: length 44.6
  Top Layer w0.254: P1.14 56.62,25.54 57.78,24.38 H2.14 57.78,7.23 57.09,6.54 X1.14
PH: length 12.1
  Top Layer w0.254: TPF5430.8 89.74,24.94 L1.1 83.44,24.81 U2.8
PH-L: length 7.4
  Top Layer w0.254: TPF5430.9 90.35,26.87 L1.2
PIN0: length 7.6
  Top Layer w0.254: H11.4 H11.3 H11.2 H11.1
PIN1: length 7.6
  Top Layer w0.254: H12.1 H12.2 H12.3 H12.4
PIN2: length 7.6
  Top Layer w0.254: H13.1 H13.2 H13.3 H13.4
VSENSE: length 4.6
  Top Layer w0.254: U2.4 87.25,14.47 87.5,14.22 90.3,14.22 TPF5430.4

Small or netless copper shapes (teardrops, artwork), in the pictures only: 179 on Top Layer, 4 on Bottom Layer

## Text on the board
Bottom Silkscreen Layer: JLCJLCJLCJLC | 实在是太抽象了... | 但也没有好的办法... / 关于FPC的板已经废板子两次了
Top Silkscreen Layer: GND | PHL | PH | VIN | ENA | VSE | NC1 | NC0 | BOT | CD | DATA1 | DATA0 | VSS | CLK | VDD | CMD | CD/DAT3 | DATA2 | QinYuYQY.
